# EAGLE design BM019 (EAGLE 8.5.1)
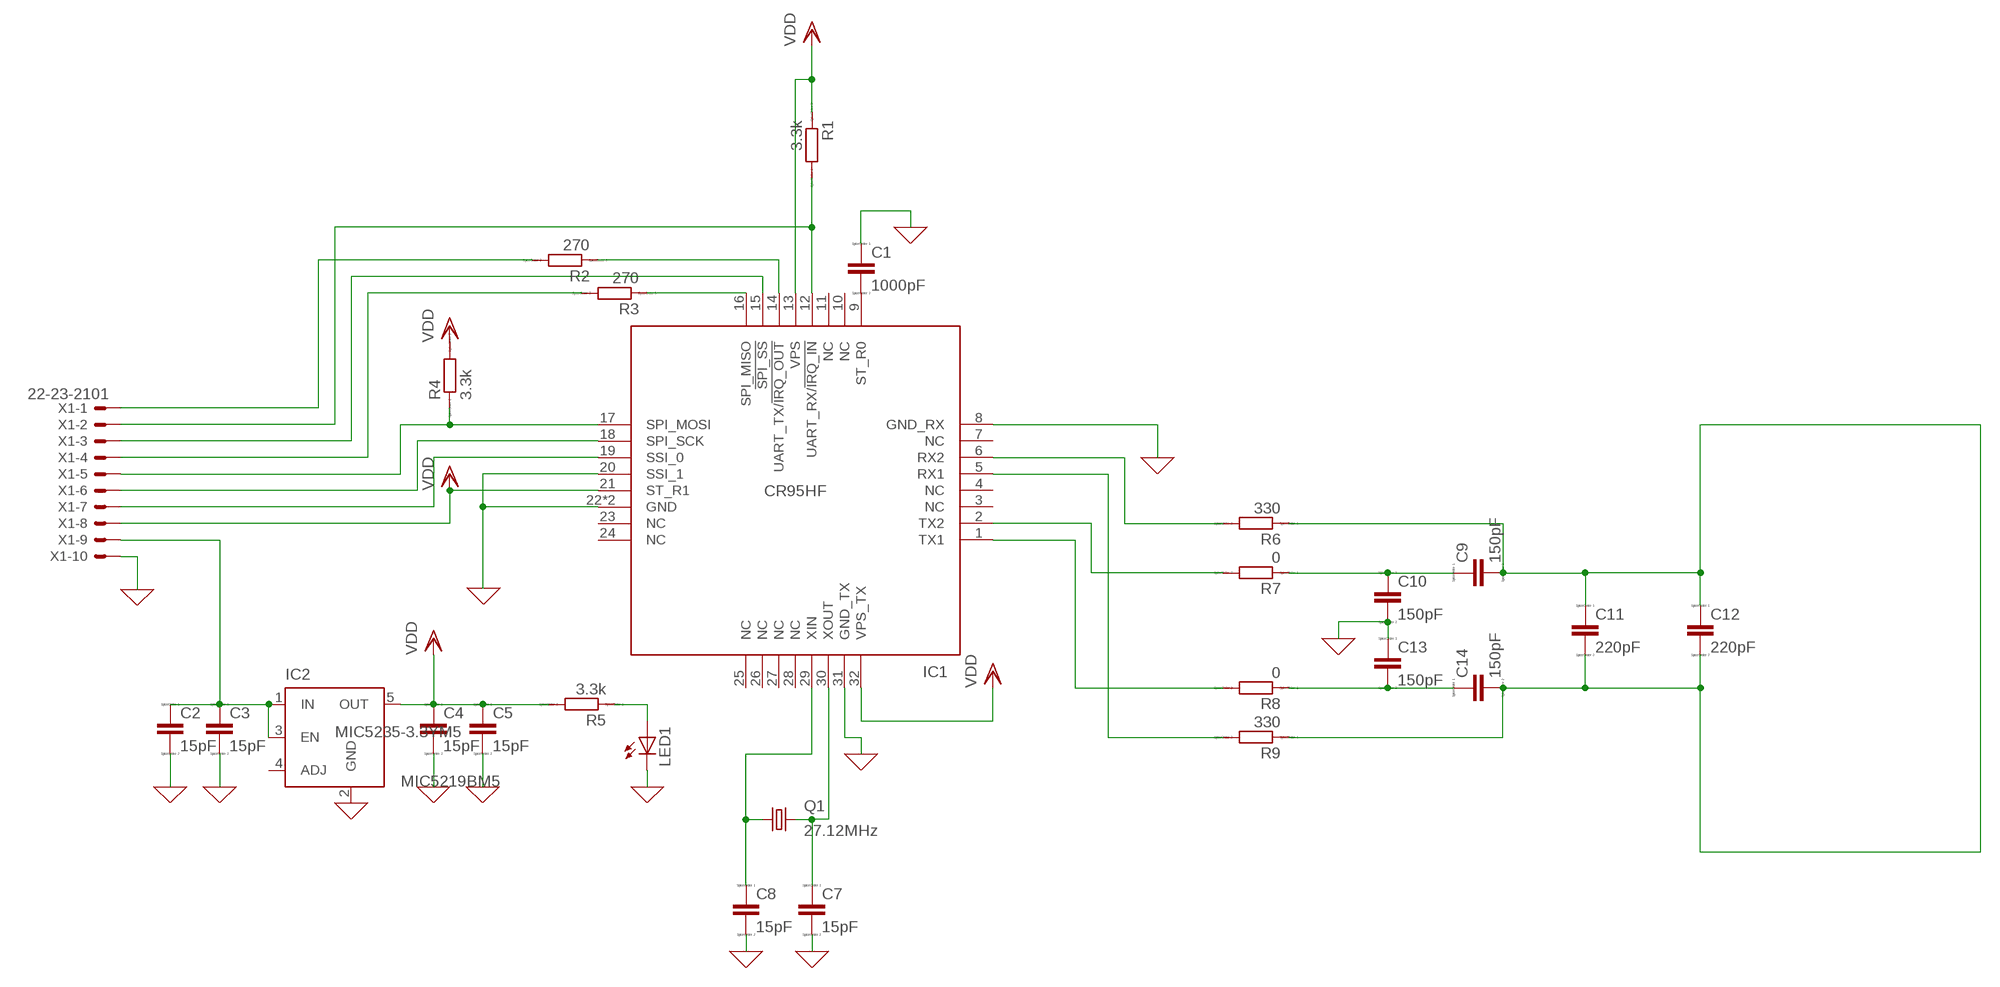
[diagram p0: schematic, sheet 1]

## Parts
C1  1000pF  CC0603  [C0603]
C2  15pF  CC0603  [C0603]
C3  15pF  CC0603  [C0603]
C4  15pF  CC0603  [C0603]
C5  15pF  CC0603  [C0603]
C7  15pF  CC0603  [C0603]
C8  15pF  CC0603  [C0603]
C9  150pF  CC0603  [C0603]
C10  150pF  CC0603  [C0603]
C11  220pF  CC0603  [C0603]
C12  220pF  CC0603  [C0603]
C13  150pF  CC0603  [C0603]
C14  150pF  CC0603  [C0603]
IC1  CR95HF  [QFN32(5X5)]
IC2  MIC5219BM5  [SOT23-5]
LED1  LEDCHIP-LED0603  [CHIP-LED0603]
Q1  27.12MHz  KX-5  [2.0X1.6_KX-5]
R1  3.3k  RR0603  [R0603]
R2  270  RR0603  [R0603]
R3  270  RR0603  [R0603]
R4  3.3k  RR0603  [R0603]
R5  3.3k  RR0603  [R0603]
R6  330  RR0603  [R0603]
R7  0  R  [R0805]
R8  0  R  [R0805]
R9  330  RR0603  [R0603]
X1  22-23-2101  [22-23-2101]

## Nets
0: C1.1 C2.2 C3.2 C4.2 C5.2 C7.2 C8.2 C10.2 C13.1 IC1.8(GND_RX) IC1.20(SSI_1) IC1.22(GND) IC1.31(GND_TX) IC1.33(GND) LED1.C X1.10 ; supply symbol labelled GND
N$1: C1.2 IC1.9(ST_R0)
N$2: LED1.A R5.1
N$3: IC1.19(SSI_0) X1.7
N$4: C2.1 C3.1 IC2.1(IN) IC2.3(EN) X1.9
N$5: IC1.6(RX2) R6.2
N$6: IC1.16(SPI_MISO) R3.1
N$7: IC1.14(UART_TX/!IRQ_OUT) R2.1
N$8: IC1.17(SPI_MOSI) R4.1 X1.5
N$9: IC1.18(SPI_SCK) X1.6
N$10: R3.2 X1.4
N$11: IC1.12(UART_RX/!IRQ_IN) R1.2 X1.2
N$12: C8.1 IC1.29(XIN) Q1.1
N$13: C7.1 IC1.30(XOUT) Q1.3
N$14: R2.2 X1.1
N$15: IC1.5(RX1) R9.2
N$16: IC1.15(!SPI_SS) X1.3
N$18: C9.2 C11.1 C11.2 C12.1 C12.2 C14.2 R6.1 R9.1
N$20: C9.1 C10.1 R7.1
N$21: C13.2 C14.1 R8.1
N$22: IC1.2(TX2) R7.2
N$23: IC1.1(TX1) R8.2
VDD: C4.1 C5.1 IC1.13(VPS) IC1.21(ST_R1) IC1.32(VPS_TX) IC2.5(OUT) R1.1 R4.2 R5.2 X1.8
Unconnected: IC1.3(NC) IC1.4(NC) IC1.7(NC) IC1.10(NC) IC1.11(NC) IC1.23(NC) IC1.24(NC) IC1.25(NC) IC1.26(NC) IC1.27(NC) IC1.28(NC) IC2.4(ADJ)

## Power pins joined to a net without a drawn wire
GND: IC2.2(GND)

## Library data of the parts
C1-C5 C7-C14 = eagle-ltspice:C: CAPACITOR, European symbol; SPICEMODEL: NONE; SPICEPREFIX: C
IC1 = Misaka-IC:CR95HF: 13.56-MHz multi-protocol contactless transceiver IC Supply voltage: 2.7...5.5V Interfaces: SPI, UART 27.12MHz crystal oscillator
IC2 = v-reg-micrel:MIC5219BM5: VOLTAGE REGULATOR; MF: MICREL; MPN: MIC5235-3.3YM5; OC_FARNELL: 1100656; OC_NEWARK: 09J8939
LED1 = led:LED: LED OSRAM: - CHIPLED LG R971, LG N971, LY N971, LG Q971, LY Q971, LO R971, LY R971 LH N974, LH R974 LS Q976, LO Q976, LY Q976 LO Q996 - Hyper CHIPLED LW Q18S LB Q993, LB Q99A, LB R99A - SideLED LS A670, LO A670, LY A670, LG A670, LP A670 LB A673, LV A673, LT A673, LW A673 LH A674 LY A675 LS A676, LA A676, LO A676, LY A676, LW A676 LS A679, LY A679, LG A679 - Hyper Micro SIDELED® LS Y876, LA Y876, LO Y876, LY Y876 LT Y87S - SmartLED LW L88C, LW L88S LB L89C, LB L89S, LG L890 LS L89K, LO L89K, LY L89K LS L896, LA L896, LO L896, LY L896 - TOPLED LS T670, LO T670, LY T670, LG T670, LP T670 LSG T670, LSP T670, LSY T670, LOP T670, LYG T670 LG T671, LOG T671, LSG T671 LB T673, LV T673, LT T673, LW T673 LH T674 LS T676, LA T676, LO T676, LY T676, LB T676, LH T676, LSB T676, LW T676 LB T67C, LV T67C, LT T67C, LS T67K, LO T67K, LY T67K, LW E67C LS E67B, LA E67B, LO E67B, LY E67B, LB E67C, LV E67C, LT E67C LW T67C LS T679, LY T679, LG T679 LS T770, LO T770, LY T770, LG T770, LP T770 LB T773, LV T773, LT T773, LW T773 LH T774 LS E675, LA E675, LY E675, LS T675 LS T776, LA T776, LO T776, LY T776, LB T776 LHGB T686 LT T68C, LB T68C - Hyper Mini TOPLED® LB M676 - Mini TOPLED Santana® LG M470 LS M47K, LO M47K, LY M47K Source: http://www.osram.convergy.de LUXEON: - LUMILED® LXK2-PW12-R00, LXK2-PW12-S00, LXK2-PW14-U00, LXK2-PW14-V00 LXK2-PM12-R00, LXK2-PM12-S00, LXK2-PM14-U00 LXK2-PE12-Q00, LXK2-PE12-R00, LXK2-PE12-S00, LXK2-PE14-T00, LXK2-PE14-U00 LXK2-PB12-K00, LXK2-PB12-L00, LXK2-PB12-M00, LXK2-PB14-N00, LXK2-PB14-P00, LXK2-PB14-Q00 LXK2-PR12-L00, LXK2-PR12-M00, LXK2-PR14-Q00, LXK2-PR14-R00 LXK2-PD12-Q00, LXK2-PD12-R00, LXK2-PD12-S00 LXK2-PH12-R00, LXK2-PH12-S00 LXK2-PL12-P00, LXK2-PL12-Q00, LXK2-PL12-R00 Source: www.luxeon.com KINGBRIGHT: KA-3528ASYC Source: www.kingbright.com
Q1 = crystal-geyer_V1_0:KX: Quartz Crystals (MHz) SMD: KX - Serie Model Size l/w/h [mm] Frequency Range Frequency Stability Temp. Range [°C] Load Capacitance AECQ 200 availabel Datasheet KX-4 KX-5 KX-6 KX-7 KX-9A KX-9B KX-12A KX-12B KX-13 KX-20 KX-K KX-KS 1.6/1.2/0.3 2.0/1.6/0.45 2.5/2.0/0.55 3.2/2.5/0.8 5.0/3.2/1.0 5.0/3.2/1.1 6.0/3.5/1.1 6.0/3.5/1.0 7.0/5.0 /1.3 11.6/5.5/1.6 12.3/4.5/4.2 12.3/4.5/3.2 24.0 ~ 80.0 MHz 16.0 ~ 80.0 MHz 12.0 ~ 80.0 MHz 8.0 ~ 60.0 MHz 7,68 ~ 300,0 MHz 8,0 ~ 50,0 MHz 8,0 ~ 150,0 MHz 8,0 ~ 50,0 MHz 6,0 ~ 160,0 MHz 3,579 ~ 25,0 MHz 3,579 ~ 70,0 MHz 3,579 ~ 70,0 MHz ±10 … ±50ppm ±10 … ±50ppm ±10 … ±50ppm ±10 … ±50ppm ±10 … ±50ppm ±10 … ±50ppm ±10 … ±50ppm ±10 … ±50ppm ±10 … ±50ppm ±50ppm ±10 … ±50ppm ±10 … ±50ppm (*) -40°C …+85°C (*) -40°C …+125°C (*) -40°C …+125°C (*) -40°C …+125°C (*) -40°C …+105°C (*) -40°C …+105°C (*) -40°C …+125°C (*) -40°C …+105°C (*) -40°C …+105°C (*) -40°C …+105°C (*) -40°C …+85°C (*) -40°C …+85°C 8, 8…16 8, 8…16 10, 8…16 12, 7…20 16, 10…20 16, 10…20 16, 10…20 16, 12…20 16, 12…20 16, 12…20 16, 12…30 16, 12…30 - yes yes yes - - - - - - - - KX-4.pdf <http://www.geyer-electronic.de/uploads/tx_userartikelfrequenz/GEYER-KX-4.pdf> KX-5.pdf <http://www.geyer-electronic.de/uploads/tx_userartikelfrequenz/GEYER-KX-5.pdf> KX-6.pdf <http://www.geyer-electronic.de/uploads/tx_userartikelfrequenz/GEYER-KX-6.pdf> KX-7.pdf <http://www.geyer-electronic.de/uploads/tx_userartikelfrequenz/GEYER-KX-7.pdf> KX-9A.pdf <http://www.geyer-electronic.de/uploads/tx_userartikelfrequenz/GEYER-KX-9A.pdf> KX-9B.pdf <http://www.geyer-electronic.de/uploads/tx_userartikelfrequenz/GEYER-KX-9B.pdf> KX-12A.pdf <http://www.geyer-electronic.de/uploads/tx_userartikelfrequenz/GEYER-KX-12A.pdf> KX-12B.pdf <http://www.geyer-electronic.de/uploads/tx_userartikelfrequenz/GEYER-KX-12B.pdf> KX-13.pdf <http://www.geyer-electronic.de/uploads/tx_userartikelfrequenz/GEYER-KX-13.pdf> KX-20.pdf <http://www.geyer-electronic.de/uploads/tx_userartikelfrequenz/GEYER-KX-20.pdf> KX-K.pdf <http://www.geyer-electronic.de/uploads/tx_userartikelfrequenz/GEYER-KX-K.pdf> KX-KS.pdf <http://www.geyer-electronic.de/uploads/tx_userartikelfrequenz/GEYER-KX-KS.pdf> <http://www.geyer-electronic.de/fileadmin/template/img/logo-geyer-electronic.png> Details see: http://www.geyer-electronic.de/Frequenz-Produkte.9.0.html Created 2016-06-07, Hans Locher 2016 (C) Geyer Quartz Technology KX4,KX5,KX6,KX7,KX9A,KX9B,KX12A,KX12B,KX13,KX20,KXK,KXKS;1612;2016;2520;3225;5032;6035;7050;11655;12345;1,6x1,2;2,0x1,6;2,5x2,0;3,2x2,5;5,0x3,2;6,0x3,5;7,0x5,0;11,6x5,5;12,3x4,5;12,3x4,5;1.6x1.2;2.0x1.6;2.5x2.0;3.2x2.5;5.0x3.2;6.0x3.5;7.0x5.0;11.6x5.5;12.3x4.5;12.3x4.5;
R1-R9 = eagle-ltspice:R: RESISTOR, European symbol; SPICEMODEL: NONE; SPICEPREFIX: R
X1 = con-molex:22-23-2101: .100" (2.54mm) Center Header - 10 Pin; MF: MOLEX; MPN: 22-23-2101; OC_FARNELL: 1756828; OC_NEWARK: 94C0765

## Board
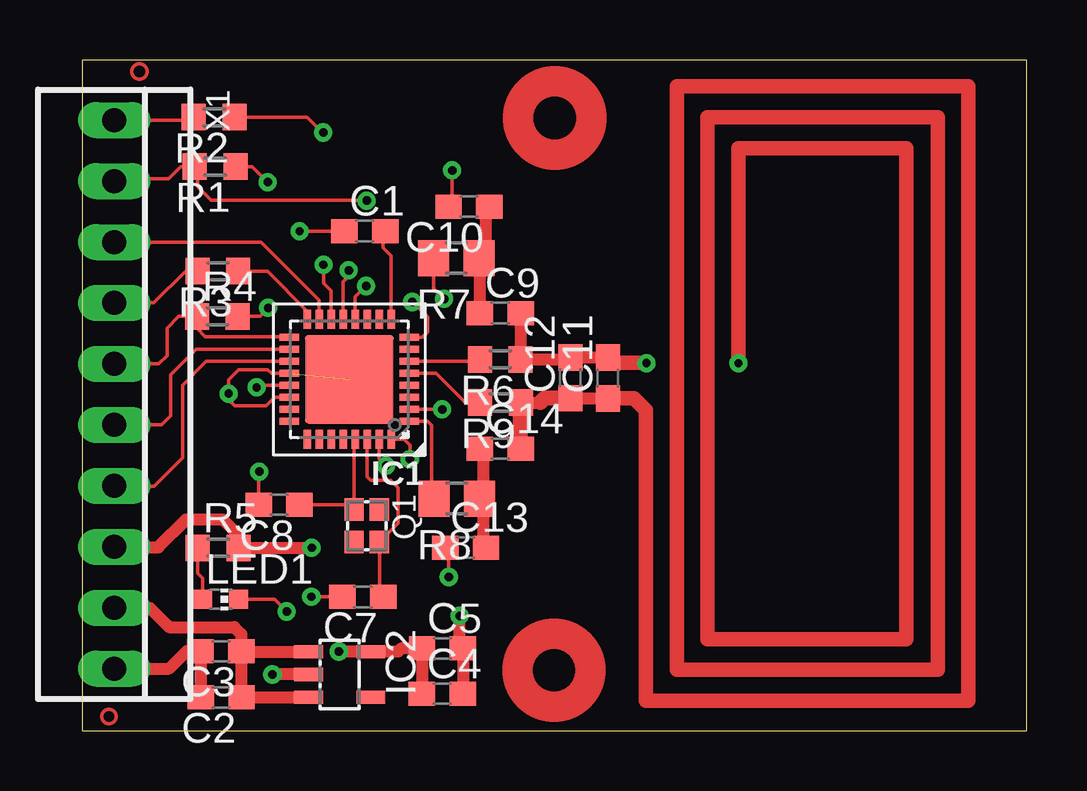
[diagram p1: board, top side]
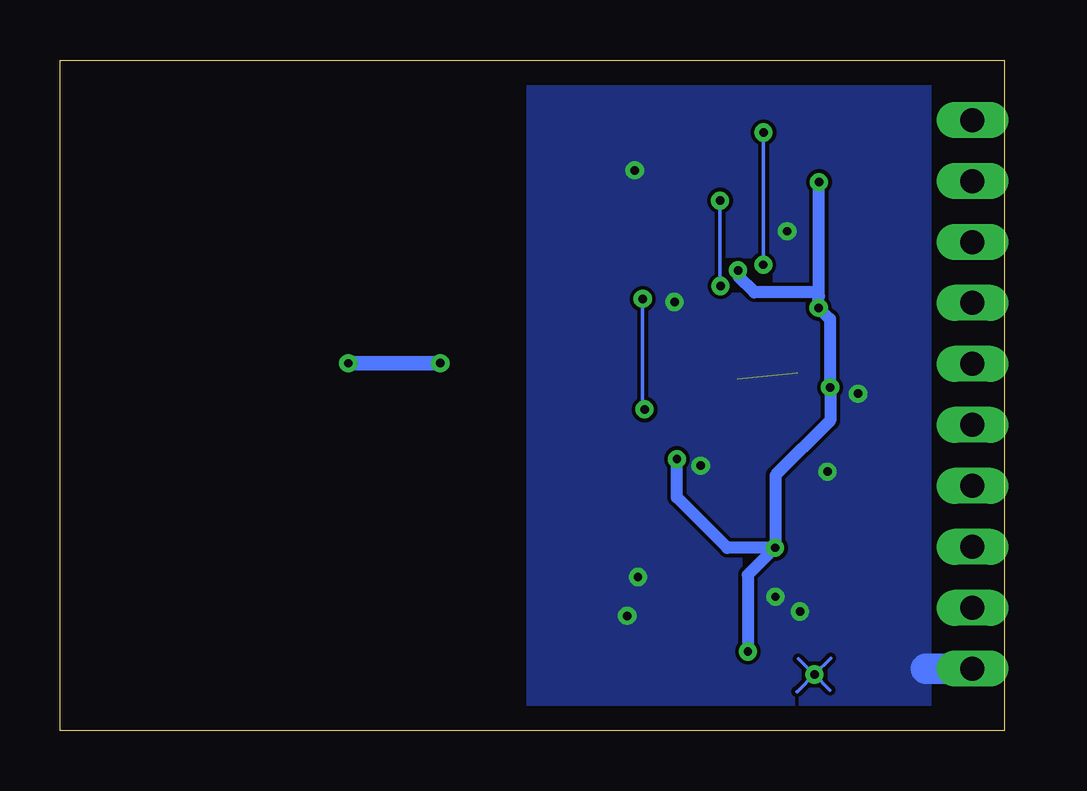
[diagram p2: board, bottom side, seen from below]

Size 39.37 x 27.94 mm. Coordinates in mm from the lower left corner, seen from the top.
Outline: 0,0 39.37,0 39.37,27.94 0,27.94 0,0
Copper layers (1*16): Top 0.035mm / dielectric 0.8mm / Bottom 0.035mm
Design rules "default *": minimum track width 6mil, minimum drill 0.35mm, track to track 6mil, track to pad 6mil, pad to pad 6mil, via to via 6mil, smd to smd 6mil, copper to edge 40mil, drill to drill 6mil, minimum pad ring 10mil, minimum via ring 8mil, stop-mask expansion 4mil, vias tented up to drill 0mil, thermal gap 10mil

### Footprints (pad centres in the part's own frame; a part is rotated, then mirrored left to right if it is on the bottom)
C0603 = smd 1.1 x 1: 1 -0.85,0; 2 0.85,0
QFN32(5X5) = smd 0.8 x 0.3: 1 -2.5,1.75; 2 -2.5,1.25; 3 -2.5,0.75; 4 -2.5,0.25; 5 -2.5,-0.25; 6 -2.5,-0.75; 7 -2.5,-1.25; 8 -2.5,-1.75; 17 2.5,-1.75; 18 2.5,-1.25; 19 2.5,-0.75; 20 2.5,-0.25; 21 2.5,0.25; 22 2.5,0.75; 23 2.5,1.25; 24 2.5,1.75 | smd 0.3 x 0.8: 9 -1.75,-2.5; 10 -1.25,-2.5; 11 -0.75,-2.5; 12 -0.25,-2.5; 13 0.25,-2.5; 14 0.75,-2.5; 15 1.25,-2.5; 16 1.75,-2.5; 25 1.75,2.5; 26 1.25,2.5; 27 0.75,2.5; 28 0.25,2.5; 29 -0.25,2.5; 30 -0.75,2.5; 31 -1.25,2.5; 32 -1.75,2.5 | smd 3.7 x 3.7: 33 0,0
SOT23-5 = smd 0.55 x 1.2: 1 -0.95,-1.3; 2 0,-1.3; 3 0.95,-1.3; 4 0.95,1.3; 5 -0.95,1.3
CHIP-LED0603 = smd 0.8 x 0.8: A 0,-0.75; C 0,0.75
2.0X1.6_KX-5 = smd 0.95 x 0.8: 1 -0.675,-0.525; 2 0.675,-0.525; 3 0.675,0.525; 4 -0.675,0.525
R0603 = smd 1 x 1.1: 1 -0.85,0; 2 0.85,0
R0805 = smd 1.3 x 1.5: 1 -0.95,0; 2 0.95,0
22-23-2101 = drill 1 long: 1 -11.43,0; 2 -8.89,0; 3 -6.35,0; 4 -3.81,0; 5 -1.27,0; 6 1.27,0; 7 3.81,0; 8 6.35,0; 9 8.89,0; 10 11.43,0

### Placement (x,y rotation side)
C1  11.77,20.81 0 top
C2  5.79,1.38 180 top
C3  5.78,3.31 180 top
C4  15,1.53 0 top
C5  15.01,3.42 0 top
C7  11.69,5.58 180 top
C8  8.2,9.41 180 top
C9  17.42,17.39 0 top
C10  16.11,21.84 180 top
C11  21.91,14.69 90 top
C12  20.34,14.7 90 top
C13  15.98,7.63 0 top
C14  17.42,11.74 0 top
IC1  11.13,14.63 180 top
IC2  10.73,2.34 270 top
LED1  5.77,5.47 270 top
Q1  11.86,8.53 270 top
R1  5.53,23.5 180 top
R2  5.49,25.56 180 top
R3  5.65,19.15 180 top
R4  5.63,17.26 0 top
R5  5.66,7.61 0 top
R6  17.42,15.47 180 top
R7  15.58,19.69 180 top
R8  15.61,9.66 180 top
R9  17.44,13.67 180 top
X1  1.33,14.01 270 top

### Tracks (layer width: path | path; a pad name or v marks a point on that pad's centre or on a via)
0  (via drill 0.35)  (1 unrouted)
  Top 0.152: 4.93,1.4 C2.2 | 15.86,1.54 C4.2 | C1.1 v9.04,20.81 9.04,20.8 v9.05,20.8 | C10.2 15.41,21.99 v15.41,23.34 | IC1.8 14.17,16.38 14.39,16.61 14.39,17.24 v13.76,17.87 | v13.76,17.87 | v13.76,17.87 v13.75,17.86 | IC1.31 12.38,11.33 v12.66,11.05 v12.66,11.04 | IC1.20 7.89,14.88 7.73,15.04 6.52,15.04 6.09,14.62 v6.09,14.04 v6.1,14.04 | v6.1,14.04 6.1,13.77 6.34,13.53 7.66,13.53 8.01,13.88 IC1.22 | C8.2 7.35,10.78 v7.36,10.79 v7.37,10.79 | LED1.C 8.02,5.47 v8.52,4.96 | C7.2 v9.55,5.58 | v9.55,5.58 | C13.1 15.27,7.49 15.27,6.39 | 15.27,6.38 15.27,6.39 | 15.27,6.39 v15.28,6.4
  Top 0.508: X1.10 3.62,2.58 4.35,3.31 C3.2 4.93,1.4 | 15.86,1.54 C5.2 15.71,3.57 15.71,4.76 15.72,4.77 v15.72,4.78
  Bottom 0.152: v6.1,14.04
  Bottom 1.27: X1.10 3.28,2.58 3.28,2.57
  pour Bottom: 3.28,27.27 19.57,27.27 19.7,27.14 19.7,0.36 19.73,0.33 3.28,0.33
GND  (via drill 0.35)
  Top 0.508: IC2.2 7.94,2.34 7.93,2.34 v7.92,2.34
  Bottom 0.152: v7.92,2.34 7.95,2.34 8.6,2.98 | v7.92,2.34 7.24,3.02 v7.92,2.34 | v7.92,2.34 7.27,1.69 | v7.92,2.34 8.63,1.62 8.66,1.62
N$1
  Top 0.152: IC1.9 12.88,19.78 12.54,20.12 12.54,20.72 C1.2
N$2
  Top 0.152: LED1.A 5.02,6.35 4.81,6.56 R5.1
N$3
  Top 0.152: X1.7 1.35,10.18 2.98,10.18 4.17,11.37 4.17,14.4 5.16,15.38 IC1.19
N$4
  Top 0.152: 3.56,4.37 3.62,4.31 | 6.63,1.4 C2.1 | C3.1 6.65,3.29 | IC2.3
  Top 0.457: X1.9 2.82,5.12
  Top 0.508: 2.82,5.12 3.56,4.37 | 3.62,4.31 6.34,4.31 6.63,4.02 C3.1 6.63,1.4 | 6.65,3.29 IC2.1 | C2.1 IC2.3
N$5
  Top 0.152: IC1.6 16.49,15.38 R6.2
N$6
  Top 0.152: R3.1 7.71,19.15 9.38,17.48 IC1.16
N$7  (via drill 0.35)
  Top 0.152: R2.1 9.36,25.56 10.01,24.91 10.01,24.9 v10.03,24.92 v10.04,24.92 | IC1.14 10.38,18.32 10.05,18.64 v10.05,19.41
  Bottom 0.152: v10.04,24.92 v10.04,19.42 v10.05,19.41
N$8
  Top 0.152: X1.5 3.18,15.28 3.53,15.62 3.53,16.77 4.02,17.26 R4.1 4.78,16.76 5.12,16.42 8.6,16.42 IC1.17
N$9
  Top 0.152: X1.6 3.3,12.74 3.68,13.12 3.68,14.82 4.74,15.88 IC1.18
N$10
  Top 0.152: X1.4 2.97,17.82 4.3,19.15 R3.2
N$11  (via drill 0.35)
  Top 0.152: X1.2 1.42,22.99 3.6,22.99 4.11,23.5 R1.2 4.8,23.38 4.8,22.66 5.37,22.09 11.87,22.09 11.86,22.08 v11.85,22.08 | IC1.12 11.38,18.07 v11.82,18.52 v11.83,18.52
  Bottom 0.152: v11.85,22.08 11.85,18.54 v11.83,18.52
N$12
  Top 0.152: Q1.1 11.33,9.43 | 11.33,9.43 11.33,12.09 IC1.29 | C8.1 11.31,9.41 11.33,9.43
N$13
  Top 0.152: IC1.30 11.88,10.57 12.02,10.43 12.84,10.43 13.15,10.12 13.16,10.12 13.16,8.63 Q1.3 12.38,5.74 C7.1
N$14
  Top 0.152: X1.1 4.52,25.44 R2.2
N$15
  Top 0.152: IC1.5 14.74,14.88 15.95,13.68 R9.2
N$16
  Top 0.152: X1.3 7.46,20.36 9.87,17.94 IC1.15
N$18  (via drill 0.35)
  Top 0.152: 18.27,13.65 R9.1 | 20.33,13.86 C12.1 | C11.1 | R6.1 18.33,15.47 18.27,15.52 | 20.26,15.47 C12.2 | C11.2
  Top 0.508: R9.1 19.09,13.67 | C12.1 C11.1 | 18.33,15.47 20.26,15.47 | C12.2 C11.2 | C9.2 18.27,15.52
  Top 0.61: C11.2 22.12,15.32 23.54,15.32 v23.52,15.31 | v27.35,15.3 27.35,24.21 27.34,24.21 27.34,24.27 34.36,24.27 34.36,3.8 26.06,3.8 26.06,25.56 35.65,25.56 35.65,2.53 24.78,2.53 24.78,26.84 36.93,26.84 36.93,1.25 23.5,1.25 23.5,13.34 23,13.84 C11.1
  Top 0.635: C14.2 18.27,13.65 | 19.09,13.67 19.28,13.86 20.33,13.86
  Bottom 0.61: v23.52,15.31 27.37,15.31 27.37,15.3 v27.35,15.3
N$20
  Top 0.152: 16.57,19.65 R7.1 16.53,20.13 16.82,20.41 | 16.82,21.69 C10.1
  Top 0.508: C9.1 16.57,19.65 | 16.82,20.41 16.82,21.69
N$21
  Top 0.152: C13.2 16.73,7.73 | 16.73,9.49 R8.1 16.56,10.02 16.73,10.2 | 16.73,11.57 C14.1
  Top 0.508: 16.73,7.73 16.73,9.49 | 16.73,10.2 16.73,11.57
N$22  (via drill 0.35)
  Top 0.152: R7.2 14.63,18.41 15.06,17.99 v15.08,17.99 | IC1.2 15.05,13.38 v15.01,13.38 v15,13.38
  Bottom 0.152: v15.08,17.99 15.08,13.46 v15,13.38
N$23
  Top 0.152: IC1.1 14.39,12.88 14.55,12.73 14.55,9.77 R8.2
VDD  (via drill 0.35)
  Top 0.152: X1.8 1.36,7.63 | 14.16,1.54 C4.1 | IC2.5 | R1.1 7.09,23.5 7.71,22.88 7.71,22.87 v7.73,22.85 | R4.2 7.4,17.26 v7.75,17.61 | IC1.13 10.88,18.69 11.1,18.91 v11.1,19.17 | IC1.32 13.41,12.13 13.65,11.89 v13.65,11.31 | IC1.21 7.35,14.38 v7.26,14.3 v7.27,14.3
  Top 0.508: 1.36,7.63 3.17,7.63 4.32,8.79 5.87,8.79 6.51,8.15 R5.2 9.52,7.61 9.53,7.61 9.55,7.61 v9.56,7.62 | 14.16,1.54 C5.1 13.3,3.42 13.17,3.29 IC2.5 | IC2.5 10.71,3.29 v10.7,3.29 v10.69,3.3
  Bottom 0.508: 7.73,18.1 v7.73,22.85 | 7.73,18.1 7.75,18.08 v7.75,17.61 7.29,17.15 7.27,17.15 v7.27,14.3 7.27,12.92 9.54,10.64 9.54,7.63 v9.56,7.62 | 7.73,18.1 7.89,18.26 10.43,18.26 11.1,18.93 v11.1,19.17 | v9.56,7.62 11.55,7.62 13.66,9.72 v13.66,11.31 v13.65,11.31 | v9.56,7.62 10.69,6.48 v10.69,3.3
(copper drawn outside any net)
  shapes: Top circle x4